# Altium schematic sheet Лист1.SchDoc
size 420 x 297 mm; Author: ALTIUM GOSTBOM2.0 KEV; DrawnBy: Khripkinvlan; SheetNumber: 1; SheetTotal: 4; Вид_документа_SCH: Схема электрическая принципиальная; Наименование2: Сервоконтроллер; п_Разраб_Р: Хрипкин В.А.; п_Пров_Р: Поберезкин Н.И.; Наименование_организации: ТПУ ИШИТР Группа 8Е11; Обозначение_Код: ФЮРА.442576.001 Э3
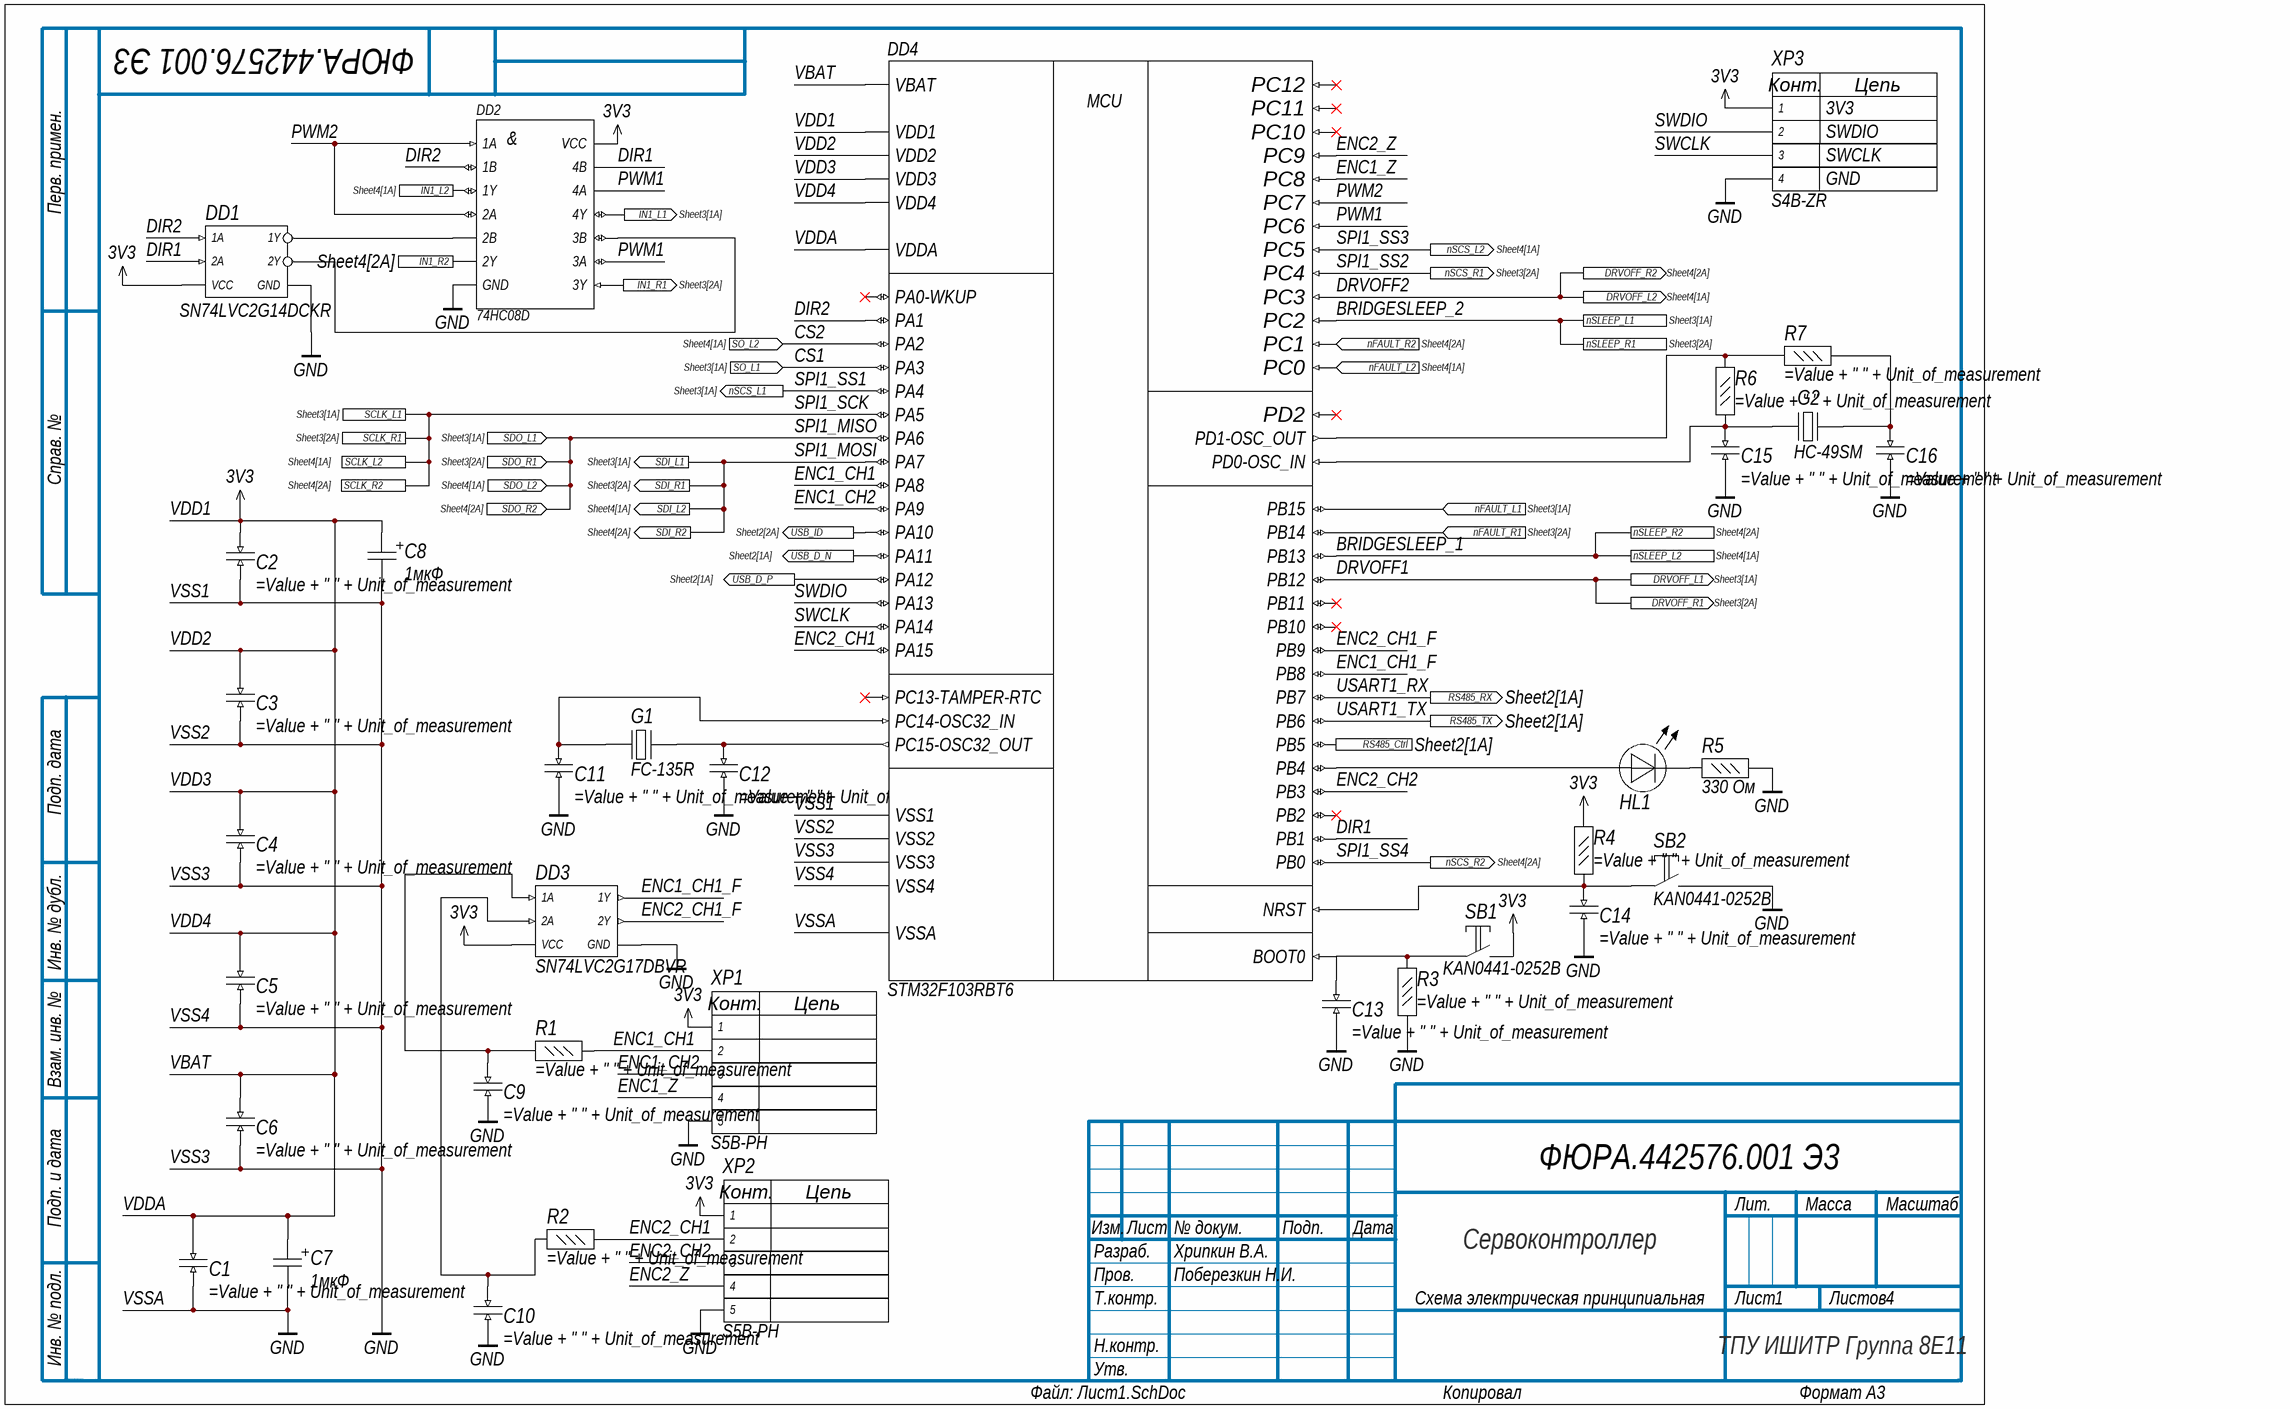
[diagram p0: Лист1.SchDoc]

## Parts
C1  (no value)  [CAP_0603]
C2  (no value)  [CAP_0603]
C3  (no value)  [CAP_0603]
C4  (no value)  [CAP_0603]
C5  (no value)  [CAP_0603]
C6  (no value)  [CAP_0603]
C7  1мкФ  [TECAP_A]
C8  1мкФ  [TECAP_A]
C9  (no value)  [CAP_0603]
C10  (no value)  [CAP_0603]
C11  (no value)  [CAP_0603]
C12  (no value)  [CAP_0603]
C13  (no value)  [CAP_0603]
C14  (no value)  [CAP_0603]
C15  (no value)  [CAP_0603]
C16  (no value)  [CAP_0603]
DD1  SN74LVC2G14DCKR  [SOT363 (SC70-6)]
DD2  74HC08D  [SO14]
DD3  SN74LVC2G17DBVR  [SOT23-6]
DD4  STM32F103RBT6  [LQFP-64]
G1  FC-135R  [FC-135R]
G2  HC-49SM  [HC-49SM]
HL1  3  [LED_0805]  (value not drawn)
R1  (no value)  [RES_0603]
R2  (no value)  [RES_0603]
R3  (no value)  [RES_0603]
R4  (no value)  [RES_0603]
R5  330 Ом  [RES_0603]
R6  (no value)  [RES_0603]
R7  (no value)  [RES_0603]
SB1  KAN0441-0252B  [SMD-BUTTON_6x3.5]
SB2  KAN0441-0252B  [SMD-BUTTON_6x3.5]
XP1  S5B-PH  [S5B-PH-K-S]
XP2  S5B-PH  [S5B-PH-K-S]
XP3  S4B-ZR  [S4B-ZR-SM4A-TF]

## Ports
DRVOFF_L1 (out, see Sheet3[1A]), DRVOFF_L2 (out, see Sheet4[1A]), DRVOFF_R1 (out, see Sheet3[2A]), DRVOFF_R2 (out, see Sheet4[2A]), IN1_L1 (out, see Sheet3[1A]), IN1_L2 (out, see Sheet4[1A]), IN1_R1 (out, see Sheet3[2A]), IN1_R2 (out, see Sheet4[2A]), nFAULT_L1 (in, see Sheet3[1A]), nFAULT_L2 (in, see Sheet4[1A]), nFAULT_R1 (in, see Sheet3[2A]), nFAULT_R2 (in, see Sheet4[2A]), nSCS_L1 (out, see Sheet3[1A]), nSCS_L2 (out, see Sheet4[1A]), nSCS_R1 (out, see Sheet3[2A]), nSCS_R2 (out, see Sheet4[2A]), nSLEEP_L1 (see Sheet3[1A]), nSLEEP_L2 (see Sheet4[1A]), nSLEEP_R1 (see Sheet3[2A]), nSLEEP_R2 (see Sheet4[2A]), RS485_Ctrl (out, see Sheet2[1A]), RS485_RX (out, see Sheet2[1A]), RS485_TX (out, see Sheet2[1A]), SCLK_L1 (see Sheet3[1A]), SCLK_L2 (see Sheet4[1A]), SCLK_R1 (see Sheet3[2A]), SCLK_R2 (see Sheet4[2A]), SDI_L1 (out, see Sheet3[1A]), SDI_L2 (out, see Sheet4[1A]), SDI_R1 (out, see Sheet3[2A]), SDI_R2 (out, see Sheet4[2A]), SDO_L1 (in, see Sheet3[1A]), SDO_L2 (in, see Sheet4[1A]), SDO_R1 (in, see Sheet3[2A]), SDO_R2 (in, see Sheet4[2A]), SO_L1 (in, see Sheet3[1A]), SO_L2 (in, see Sheet4[1A]), USB_D_N (out, see Sheet2[1A]), USB_D_P (out, see Sheet2[1A]), USB_ID (out, see Sheet2[2A])

## Nets
VBAT: C1.2 C2.2 C3.2 C4.2 C5.2 C6.2 C7.1 C8.1 DD1.5(VCC) DD2.14(VCC) DD3.5(VCC) DD4.1(VBAT) DD4.13(VDDA) DD4.19(VDD1) DD4.32(VDD2) DD4.48(VDD3) DD4.64(VDD4) R4.2 SB1.2(S2) XP1.1 XP2.1 XP3.1  [also labelled 3V3, VDD1, VDD2, VDD3, VDD4, VDDA]
VSS1: C1.1 C2.1 C3.1 C4.1 C5.1 C6.1 C7.2 C8.2 C9.1 C10.1 C11.1 C12.1 C13.1 C14.1 C15.1 C16.1 DD1.2(GND) DD2.7(GND) DD3.2(GND) DD4.12(VSSA) DD4.18(VSS1) DD4.31(VSS2) DD4.47(VSS3) DD4.63(VSS4) R3.2 R5.2 SB2.2(S2) XP1.5 XP2.5 XP3.4  [also labelled GND, VSS2, VSS3, VSS4, VSSA]
BRIDGESLEEP_1: DD4.34(PB13) ; port nSLEEP_L2, port nSLEEP_R2
BRIDGESLEEP_2: DD4.10(PC2) ; port nSLEEP_L1, port nSLEEP_R1
CS1: DD4.17(PA3) ; port SO_L1
CS2: DD4.16(PA2) ; port SO_L2
DIR1: DD1.3(2A) DD2.13(4B) DD4.27(PB1)
DIR2: DD1.1(1A) DD2.2(1B) DD4.15(PA1)
DRVOFF1: DD4.33(PB12) ; port DRVOFF_L1, port DRVOFF_R1
DRVOFF2: DD4.11(PC3) ; port DRVOFF_L2, port DRVOFF_R2
ENC1_CH1: DD4.41(PA8) R1.2 XP1.2
ENC1_CH1_F: DD3.6(1Y) DD4.61(PB8)
ENC1_CH2: DD4.42(PA9) XP1.3
ENC1_Z: DD4.39(PC8) XP1.4
ENC2_CH1: DD4.50(PA15) R2.2 XP2.2
ENC2_CH1_F: DD3.4(2Y) DD4.62(PB9)
ENC2_CH2: DD4.55(PB3) XP2.3
ENC2_Z: DD4.40(PC9) XP2.4
IN1_L1: DD2.11(4Y) ; port IN1_L1
IN1_L2: DD2.3(1Y) ; port IN1_L2
IN1_R1: DD2.8(3Y) ; port IN1_R1
IN1_R2: DD2.6(2Y) ; port IN1_R2
nFAULT_L1: DD4.36(PB15) ; port nFAULT_L1
nFAULT_L2: DD4.8(PC0) ; port nFAULT_L2
nFAULT_R1: DD4.35(PB14) ; port nFAULT_R1
nFAULT_R2: DD4.9(PC1) ; port nFAULT_R2
PWM1: DD2.9(3A) DD2.12(4A) DD4.37(PC6)
PWM2: DD2.1(1A) DD2.4(2A) DD4.38(PC7)
RS485_Ctrl: DD4.57(PB5) ; port RS485_Ctrl
SPI1_MISO: DD4.22(PA6) ; port SDO_L1, port SDO_R1, port SDO_L2, port SDO_R2
SPI1_MOSI: DD4.23(PA7) ; port SDI_L1, port SDI_R1, port SDI_L2, port SDI_R2
SPI1_SCK: DD4.21(PA5) ; port SCLK_L1, port SCLK_R1, port SCLK_L2, port SCLK_R2
SPI1_SS1: DD4.20(PA4) ; port nSCS_L1
SPI1_SS2: DD4.24(PC4) ; port nSCS_R1
SPI1_SS3: DD4.25(PC5) ; port nSCS_L2
SPI1_SS4: DD4.26(PB0) ; port nSCS_R2
SWCLK: DD4.49(PA14) XP3.3
SWDIO: DD4.46(PA13) XP3.2
USART1_RX: DD4.59(PB7) ; port RS485_RX
USART1_TX: DD4.58(PB6) ; port RS485_TX
USB_D_N: DD4.44(PA11) ; port USB_D_N
USB_D_P: DD4.45(PA12) ; port USB_D_P
USB_ID: DD4.43(PA10) ; port USB_ID
NetC9_2: C9.2 DD3.1(1A) R1.1
NetC10_2: C10.2 DD3.3(2A) R2.1
NetC11_2: C11.2 DD4.3(PC14-OSC32_IN) G1.1
NetC12_2: C12.2 DD4.4(PC15-OSC32_OUT) G1.2
NetC13_2: C13.2 DD4.60(BOOT0) R3.1 SB1.1(S1)
NetC14_2: C14.2 DD4.7(NRST) R4.1 SB2.1(S1)
NetC15_2: C15.2 DD4.5(PD0-OSC_IN) G2.1 R6.1
NetC16_2: C16.2 G2.2 R7.2
NetDD1_4: DD1.4(2Y) DD2.10(3B)
NetDD1_6: DD1.6(1Y) DD2.5(2B)
NetDD4_6: DD4.6(PD1-OSC_OUT) R6.2 R7.1
NetDD4_56: DD4.56(PB4) HL1.A
NetHL1_C: HL1.C R5.1

Not connected (* = marked no-connect by the designer): DD4 2(PC13-TAMPER-RTC)* 14(PA0-WKUP)* 28(PB2)* 29(PB10)* 30(PB11)* 51(PC10)* 52(PC11)* 53(PC12)* 54(PD2)*

## Notes on the sheet
- SWDIO
- SWCLK
- 3V3
- GND
- Перв. примен.
- Справ. №
- Подп. дата
- Инв. № дубл.
- Взам. инв. №
- Подп. и дата
- Изм.
- Разраб.
- Лист
- № докум.
- Подп.
- Дата
- Лит.
- Масса
- Масштаб
- Пров.
- Т.контр.
- Листов
- Инв. № подл.
- Н.контр.
- Утв.
- ALTIUM GOSTBOM2.0 KEV
- Файл:
- Копировал
- Формат А3
- (in symbol 74HC08D) &
- (in symbol S4B-ZR) Конт.; Цепь
- (in symbol S5B-PH) Конт.; Цепь
- (in symbol STM32F103RBT6) MCU

## Library data of the parts
C1-C6 C13 C14 = CAP_0603: Конденсатор керамический, типоразмера 0603; Value: 100; Unit_of_measurement: нФ; ComponentLink1Description: New link; ComponentLink1URL: *
C7 C8 = TECAP_A: Описание свойств компонента; Value: 1; Unit_of_measurement: мкФ
C9 C10 = CAP_0603: Конденсатор керамический, типоразмера 0603; Value: 10; Unit_of_measurement: пФ; ComponentLink1Description: New link; ComponentLink1URL: *
C11 C12 C15 C16 = CAP_0603: Конденсатор керамический, типоразмера 0603; Value: 20; Unit_of_measurement: пФ; ComponentLink1Description: New link; ComponentLink1URL: *
DD1 = SN74LVC2G14DCKR: Сдвоенный инвертор с триггером Шмидта
DD2 = 74HC08D: Логическая ИС, QUAD 2-INPUT AND GATE
DD3 = SN74LVC2G17DBVR: Сдвоенный буфер с триггером Шмитта на входе
DD4 = STM32F103RBT6: Микроконтроллер 32-Бит, Cortex-M3, 72МГц, 128КБ Flash, USB, CAN [LQFP-64]
G1 = FC-135R: Кварцевый резонатор 32,768 кГц; SMD; ComponentLink1Description: Datasheet; ComponentLink1URL: C:\GitHub\OvcharkaBoard\Datasheets\Components
G2 = HC-49SM: Кварцевый резонатор 8 МГц; SMD; ComponentLink1Description: Datasheet; ComponentLink1URL: C:\GitHub\OvcharkaBoard\Datasheets\Components
HL1 = LED_0805_O: Светодиод оранжевый SMD 0805=2x1.3мм, 70мКд, 130°, 625нм (Orange); №7339 o СД SMD02013C2\оран\ 70\130\пр\FYLS-0805UEC\; Unit_of_measurement: Ом; Value: *; ComponentLink1Description: New link; ComponentLink1URL: *
R1 R2 R7 = RES_0603: Резистор, типоразмера 0603; Value: 100; Unit_of_measurement: кОм; ComponentLink1Description: New link; ComponentLink1URL: *
R3 R4 = RES_0603: Резистор, типоразмера 0603; Value: 10; Unit_of_measurement: кОм; ComponentLink1Description: New link; ComponentLink1URL: *
R5 = RES_0603: Резистор, типоразмера 0603; Value: 330; ComponentLink1Description: New link; ComponentLink1URL: *; Unit_of_measurement: Ом
R6 = RES_0603: Резистор, типоразмера 0603; Value: 1; Unit_of_measurement: МОм; ComponentLink1Description: New link; ComponentLink1URL: *
SB1 SB2 = SMD-Button_6x3.5: Описание свойств компонента
XP1 XP2 = S5B-PH: JST PH 5pin 2 mm pitch; horizontal; through hole OR full smd; S5B-PH-SM4-TB
XP3 = S4B-ZR: JST ZH 4pin 1.5 mm pitch; horizontal; through hole OR full smd; S4B-ZR